# EAGLE schematic ESP8266 MegaD top board (EAGLE 7.5.0)
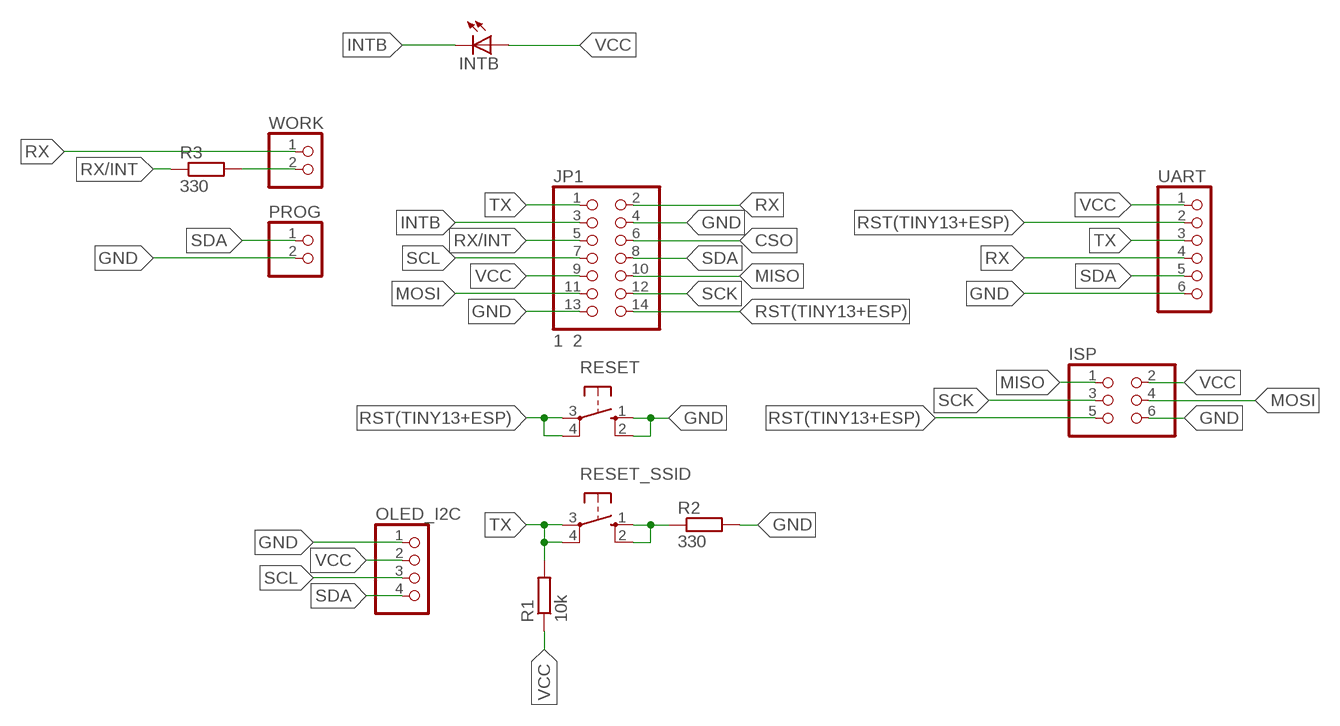
[diagram p0: schematic, sheet 1]

## Parts
INTB  LED3MM  [LED3MM]
ISP  PINHD-2X3  [2X03]
JP1  1 2  PINHD-2X7  [2X07]
OLED_I2C  PINHD-1X4  [1X04]
PROG  PINHD-1X2/90  [1X02/90]
R1  10k  R-EU_R1206  [R1206]
R2  330  R-EU_R1206  [R1206]
R3  330  R-EU_R1206  [R1206]
RESET  10-XX  [B3F-10XX]
RESET_SSID  10-XX  [B3F-10XX]
UART  PINHD-1X6  [1X06]
WORK  PINHD-1X2/90  [1X02/90]

## Nets
CSO: JP1.6
GND: ISP.6 JP1.4 JP1.13 OLED_I2C.1 PROG.2 R2.2 RESET.1(S) RESET.2(S1) UART.6
INTB: INTB.K(C) JP1.3
MISO: ISP.1 JP1.10
MOSI: ISP.4 JP1.11
N$1: R2.1 RESET_SSID.1(S) RESET_SSID.2(S1)
N$2: R3.2 WORK.2
RST(TINY13+ESP): ISP.5 JP1.14 RESET.3(P) RESET.4(P1) UART.2
RX: JP1.2 UART.4 WORK.1
RX/INT: JP1.5 R3.1
SCK: ISP.3 JP1.12
SCL: JP1.7 OLED_I2C.3
SDA: JP1.8 OLED_I2C.4 PROG.1 UART.5
TX: JP1.1 R1.2 RESET_SSID.3(P) RESET_SSID.4(P1) UART.3
VCC: INTB.A ISP.2 JP1.9 OLED_I2C.2 R1.1 UART.1

## Library data of the parts
INTB = led:LED: LED OSRAM: - CHIPLED LG R971, LG N971, LY N971, LG Q971, LY Q971, LO R971, LY R971 LH N974, LH R974 LS Q976, LO Q976, LY Q976 LO Q996 - Hyper CHIPLED LW Q18S LB Q993, LB Q99A, LB R99A - SideLED LS A670, LO A670, LY A670, LG A670, LP A670 LB A673, LV A673, LT A673, LW A673 LH A674 LY A675 LS A676, LA A676, LO A676, LY A676, LW A676 LS A679, LY A679, LG A679 - Hyper Micro SIDELED® LS Y876, LA Y876, LO Y876, LY Y876 LT Y87S - SmartLED LW L88C, LW L88S LB L89C, LB L89S, LG L890 LS L89K, LO L89K, LY L89K LS L896, LA L896, LO L896, LY L896 - TOPLED LS T670, LO T670, LY T670, LG T670, LP T670 LSG T670, LSP T670, LSY T670, LOP T670, LYG T670 LG T671, LOG T671, LSG T671 LB T673, LV T673, LT T673, LW T673 LH T674 LS T676, LA T676, LO T676, LY T676, LB T676, LH T676, LSB T676, LW T676 LB T67C, LV T67C, LT T67C, LS T67K, LO T67K, LY T67K, LW E67C LS E67B, LA E67B, LO E67B, LY E67B, LB E67C, LV E67C, LT E67C LW T67C LS T679, LY T679, LG T679 LS T770, LO T770, LY T770, LG T770, LP T770 LB T773, LV T773, LT T773, LW T773 LH T774 LS E675, LA E675, LY E675, LS T675 LS T776, LA T776, LO T776, LY T776, LB T776 LHGB T686 LT T68C, LB T68C - Hyper Mini TOPLED® LB M676 - Mini TOPLED Santana® LG M470 LS M47K, LO M47K, LY M47K Source: http://www.osram.convergy.de LUXEON: - LUMILED® LXK2-PW12-R00, LXK2-PW12-S00, LXK2-PW14-U00, LXK2-PW14-V00 LXK2-PM12-R00, LXK2-PM12-S00, LXK2-PM14-U00 LXK2-PE12-Q00, LXK2-PE12-R00, LXK2-PE12-S00, LXK2-PE14-T00, LXK2-PE14-U00 LXK2-PB12-K00, LXK2-PB12-L00, LXK2-PB12-M00, LXK2-PB14-N00, LXK2-PB14-P00, LXK2-PB14-Q00 LXK2-PR12-L00, LXK2-PR12-M00, LXK2-PR14-Q00, LXK2-PR14-R00 LXK2-PD12-Q00, LXK2-PD12-R00, LXK2-PD12-S00 LXK2-PH12-R00, LXK2-PH12-S00 LXK2-PL12-P00, LXK2-PL12-Q00, LXK2-PL12-R00 Source: www.luxeon.com KINGBRIGHT: KA-3528ASYC Source: www.kingbright.com
ISP = pinhead:PINHD-2X3: PIN HEADER
JP1 = pinhead:PINHD-2X7: PIN HEADER
OLED_I2C = pinhead:PINHD-1X4: PIN HEADER
PROG WORK = pinhead:PINHD-1X2: PIN HEADER
R1-R3 = rcl:R-EU_: RESISTOR, European symbol
RESET RESET_SSID = switch-omron:10-XX: OMRON SWITCH; MPN: B3F-1000; OC_FARNELL: 176432; OC_NEWARK: 36M3542
UART = pinhead:PINHD-1X6: PIN HEADER